# Altium schematic sheet SD.SchDoc
size A; DocumentNumber: 5; SheetNumber: 5; SheetTotal: 6
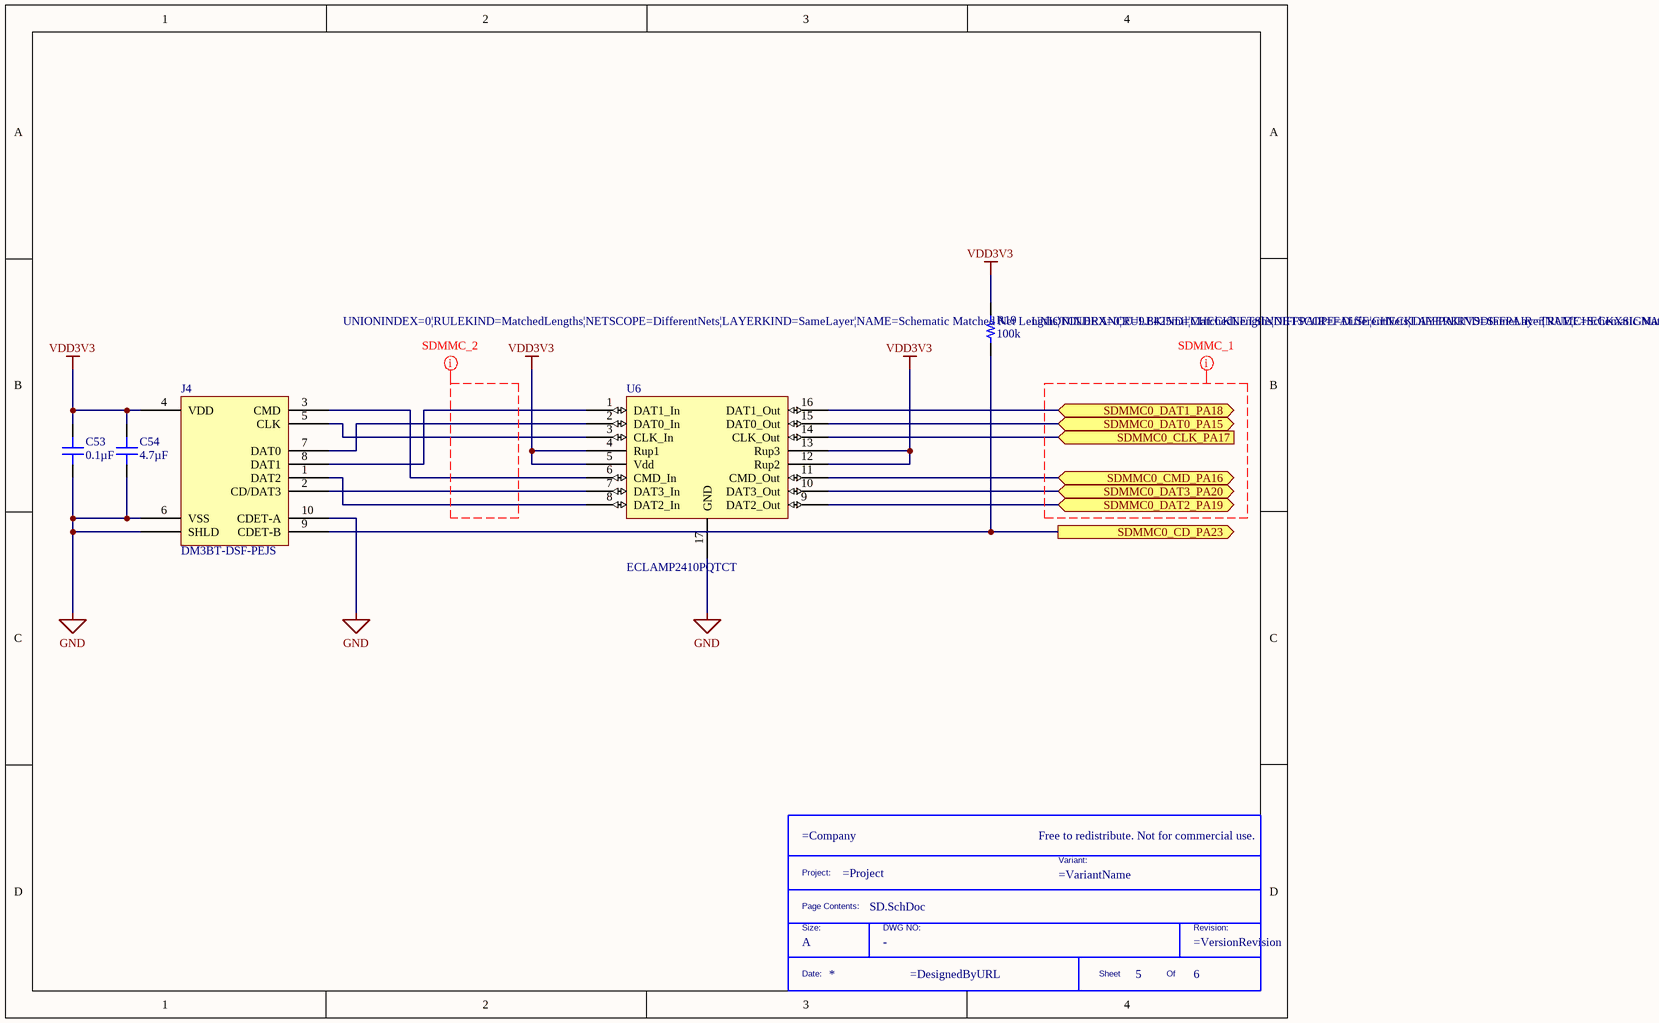
[diagram p0: SD.SchDoc]

## Parts
*  Size: A  (hidden comment: TitleBlock)  (graphical)
C53  0.1µF  [CAP 0402_1005]
C54  4.7µF  [CAP 0402_1005]
J4  DM3BT-DSF-PEJS  [HIROSE DM3BT-DSF-PEJS]
R19  100k  [RES 0402_1005]
U6  ECLAMP2410PQTCT  [SON50P160X65_HS-17N]

## Ports
SDMMC0_CD_PA23 (out), SDMMC0_CLK_PA17 (in), SDMMC0_CMD_PA16 (bidir), SDMMC0_DAT0_PA15 (bidir), SDMMC0_DAT1_PA18 (bidir), SDMMC0_DAT2_PA19 (bidir), SDMMC0_DAT3_PA20 (bidir)

## Nets
GND: C53.2 C54.1 J4.6(VSS) J4.10(CDET-A) J4.S(SHLD) U6.17(GND)
VDD3V3: C53.1 C54.2 J4.4(VDD) R19.2 U6.4(Rup1) U6.5(Vdd) U6.12(Rup2) U6.13(Rup3)
SDMMC0_CD_PA23: J4.9(CDET-B) R19.1 ; port SDMMC0_CD_PA23
SDMMC0_CLK_PA17: U6.14(CLK_Out) ; port SDMMC0_CLK_PA17
SDMMC0_CMD_PA16: U6.11(CMD_Out) ; port SDMMC0_CMD_PA16
SDMMC0_DAT0_PA15: U6.15(DAT0_Out) ; port SDMMC0_DAT0_PA15
SDMMC0_DAT1_PA18: U6.16(DAT1_Out) ; port SDMMC0_DAT1_PA18
SDMMC0_DAT2_PA19: U6.9(DAT2_Out) ; port SDMMC0_DAT2_PA19
SDMMC0_DAT3_PA20: U6.10(DAT3_Out) ; port SDMMC0_DAT3_PA20
NetJ4_1: J4.1(DAT2) U6.8(DAT2_In)
NetJ4_2: J4.2(CD/DAT3) U6.7(DAT3_In)
NetJ4_3: J4.3(CMD) U6.6(CMD_In)
NetJ4_5: J4.5(CLK) U6.3(CLK_In)
NetJ4_7: J4.7(DAT0) U6.2(DAT0_In)
NetJ4_8: J4.8(DAT1) U6.1(DAT1_In)

## Layout directives
rule Matched Net Lengths [Tolerance = 0.25mm]: (no net found under the mark)

## Notes on the sheet
- (in symbol TitleBlock) Free to redistribute. Not for commercial use.; Project:; Variant:; Page Contents:; Size:; DWG NO:; Revision:; Date:; Sheet; Of

## Library data of the parts
* = TitleBlock: Custom Title Block; DWG: -
C53 = C0402C104K4PACTU: CAP CER 0.1UF 16V X5R 0402; Manufacturer: KEMET; Tolerance: ±10%; Part Number: C0402C104K4PACTU; Value: 0.1µF; Applications: General Purpose; Capacitance: 0.1µF; ComponentLink1Description: Datasheet; ComponentLink1URL: https://api.kemet.com/component-edge/download/datasheet/C0402C104K4PACTU.pdf; ComponentLink2Description: DigiKey Link; ComponentLink2URL: http://digikey.com/product-detail/en/kemet/C0402C104K4PACTU/399-7762-1-ND/3471485; Device Package: 0402 (1005 Metric); LastUpdated: 9/2/2020 1:02:03 AM; Lifecycle Status: Active; Minimum Order: 1; Mounting Type: Surface Mount, MLCC; Operating Temperature: -55°C ~ 85°C; Package / Case: 0402 (1005 Metric); Packaging: TapeAndReel; PartId: 11334; Part Status: Active; Price: 0.01; Series: SMD Comm X5R; Size / Dimension: 0.039" L x 0.020" W (1.00mm x 0.50mm); Supplier 1: DigiKey; Supplier Part Number 1: 399-7762-1-ND; Temperature Coefficient: X5R; Thickness (Max): 0.022" (0.55mm); Voltage - Rated: 16V
C54 = CL05A475KP5NRNC: CAP CER 4.7UF 10V X5R 0402; Manufacturer: Samsung Electro-Mechanics; Tolerance: ±10%; Part Number: CL05A475KP5NRNC; Value: 4.7µF; Applications: General Purpose; Capacitance: 4.7µF; ComponentLink1Description: Datasheet; ComponentLink1URL: http://www.samsungsem.com/kr/support/product-search/mlcc/CL05A475KP5NRNC.jsp; ComponentLink2Description: DigiKey Link; ComponentLink2URL: http://digikey.com/product-detail/en/samsung-electro-mechanics/CL05A475KP5NRNC/1276-1480-1-ND/3889566; Device Package: 0402 (1005 Metric); LastUpdated: 9/2/2020 1:02:23 AM; Lifecycle Status: Active; Minimum Order: 1; Mounting Type: Surface Mount, MLCC; Operating Temperature: -55°C ~ 85°C; Package / Case: 0402 (1005 Metric); Packaging: TapeAndReel; PartId: 2191; Part Status: Active; Price: 0.08; Series: CL; Size / Dimension: 0.039" L x 0.020" W (1.00mm x 0.50mm); Supplier 1: DigiKey; Supplier Part Number 1: 1276-1480-1-ND; Temperature Coefficient: X5R; Thickness (Max): 0.022" (0.55mm); Voltage - Rated: 10V
J4 = DM3BT-DSF-PEJS: CONN MICRO SD CARD PUSH-PUSH R/A; Manufacturer: Hirose Electric Co Ltd; Card Type: Secure Digital - microSD™; Connector Type: Connector and Ejector; Insertion, Removal Method: Push In, Push Out; Number of Positions: 10 (8 + 2); Part Number: DM3BT-DSF-PEJS; ComponentLink1Description: Datasheet; ComponentLink1URL: https://www.hirose.com/product/download/?distributor=digikey&type=specSheet&lang=en&num=DM3BT-DSF-PEJS; ComponentLink2Description: DigiKey Link; ComponentLink2URL: //digikey.com/product-detail/en/hirose-electric-co-ltd/DM3BT-DSF-PEJS/HR1942TR-ND/1982749; Contact Finish: Gold; Features: Switch; Height Above Board: 0.072" (1.83mm); LastUpdated: 12/16/2019 8:35:34 PM; Lifecycle Status: 0; Minimum Order: 1; Mounting Feature: Reverse - Bottom; Mounting Type: Surface Mount, Right Angle; Packaging: TapeAndReel; Part Status: Active; Price: 1.25; Series: DM3; Supplier 1: DigiKey; Supplier Part Number 1: HR1942TR-ND
R19 = CRCW0402100KFKEDC: RES SMD 100K OHM 1% 1/16W 0402; Manufacturer: Vishay Dale; Power (Watts): 0.063W, 1/16W; Resistance: 100 kOhms; Temperature Coefficient: ±100ppm/°C; Part Number: CRCW0402100KFKEDC; Value: 100k; ComponentLink1Description: Datasheet; ComponentLink1URL: http://www.vishay.com/docs/28773/crcwce3.pdf; ComponentLink2Description: DigiKey Link; ComponentLink2URL: http://digikey.com/product-detail/en/vishay-dale/CRCW0402100KFKEDC/541-3960-1-ND/7928643; Composition: Thick Film; Device Package: 0402 (1005 Metric); Height - Seated (Max): 0.014" (0.35mm); LastUpdated: 9/2/2020 1:07:49 AM; Lifecycle Status: Active; Minimum Order: 1; Number of Terminations: 2; Operating Temperature: -55°C ~ 155°C; Package / Case: 0402 (1005 Metric); Packaging: CutTape; PartId: 12665; Part Status: Active; Price: 0.10; Series: CRCW-C; Size / Dimension: 0.039" L x 0.020" W (1.00mm x 0.50mm); Supplier 1: DigiKey; Supplier Part Number 1: 541-3960-1-ND; Supplier Device Package: 0402; Tolerance: ±1%
U6 = ECLAMP2410PQTCT: ESD Suppressors / TVS Diodes 5V 6-Line AEC-Q100 SLP4016P16; Manufacturer: Semtech; Number of Channels: 8; ESD Protection: Yes; Supplier 1: Digi-Key; Manufacturer Part Number: ECLAMP2410PQTCT; RoHS: Yes; Category: Uncategorized; Stock 1: 575; Pricing 1: 1=1.60000, 10=1.42800, 100=1.11320, 500=0.91960, 1000=0.72600 (USD); Min Operating Temperature: -40°C; Max Operating Temperature: 125°C; Package Quantity: 1; Packaging: Tape and Reel; Length: 0.157inch; Width: 0.063inch; Height: 0.026inch; RoHS Compliant: Yes; ComponentLink1URL: https://datasheet.ciiva.com/29369/eclamp2410pq-29369285.pdf?src-supplier=Digi-Key; ComponentLink1Description: https://datasheet.ciiva.com/29369/eclamp2410pq-29369285.pdf?src-supplier=Digi-Key; ComponentLink2URL: https://datasheet.ciiva.com/29369/eclamp2410pq-29369287.pdf?src-supplier=Digi-Key; ComponentLink2Description: https://datasheet.ciiva.com/29369/eclamp2410pq-29369287.pdf?src-supplier=Digi-Key; ComponentLink3URL: https://datasheet.ciiva.com/29369/eclamp2410pq-29369288.pdf?src-supplier=Digi-Key; ComponentLink3Description: https://datasheet.ciiva.com/29369/eclamp2410pq-29369288.pdf?src-supplier=Digi-Key; Supplier Part Number 1: ECLAMP2410PQTCTCT-ND